# Altium schematic sheet Invertor.SchDoc (part 1 of 2)
size A0; SheetNumber: 1; SheetTotal: 1
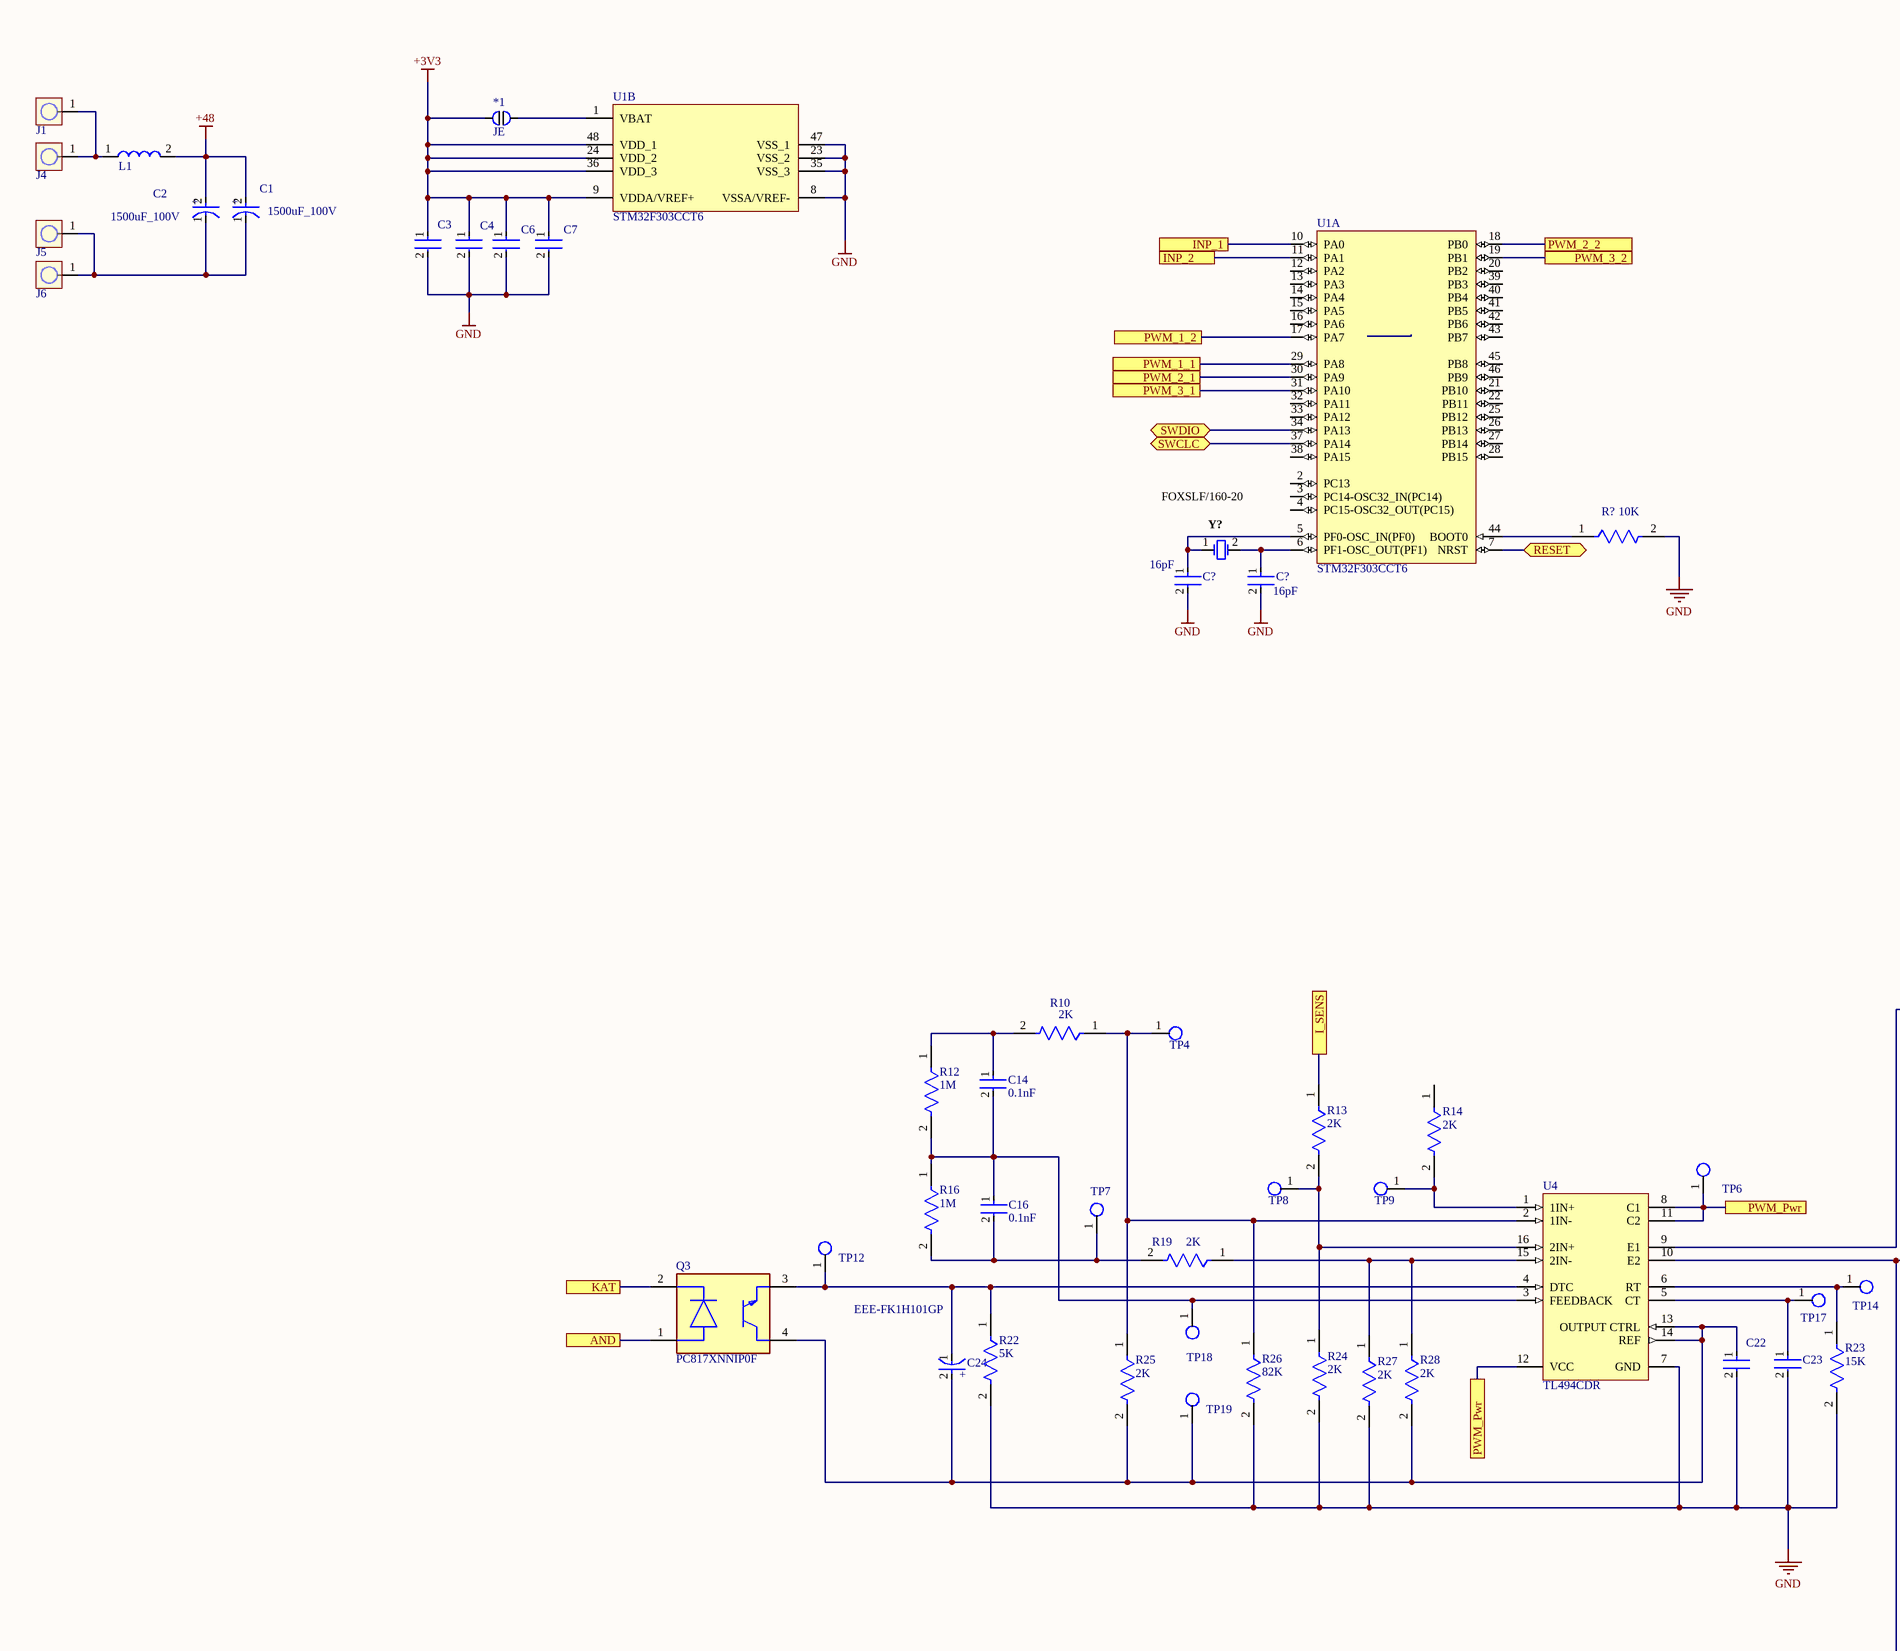
[diagram p0: Invertor.SchDoc, top left]
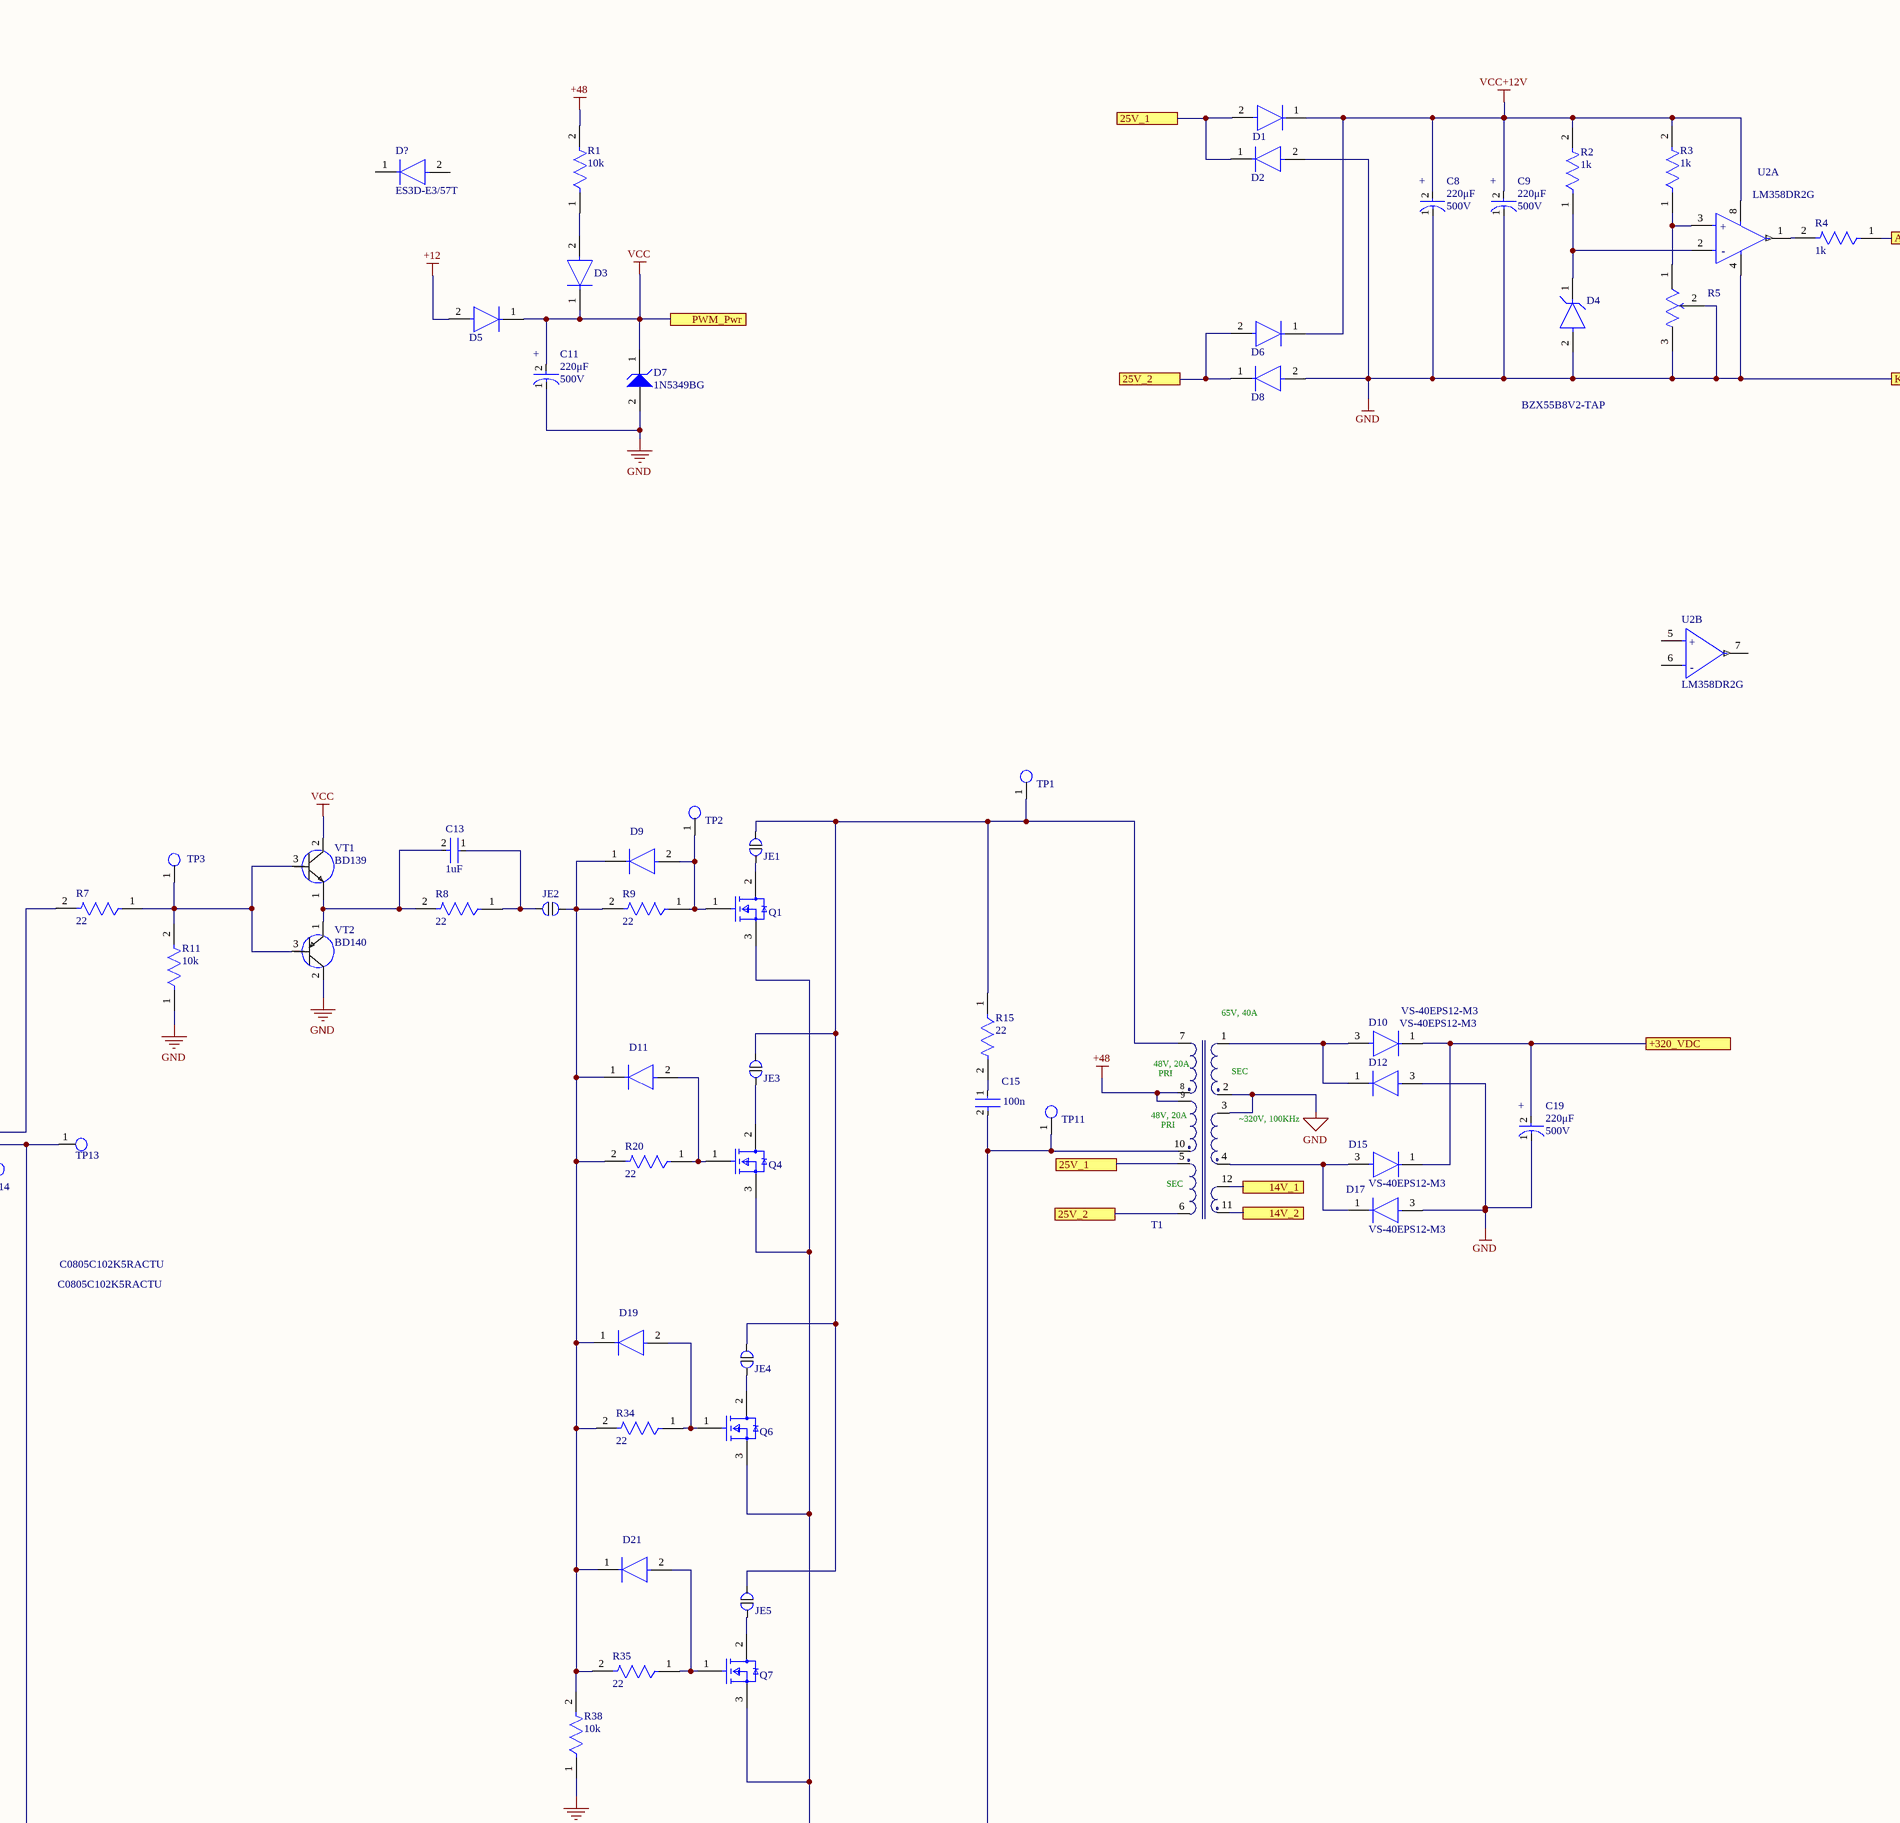
[diagram p1: Invertor.SchDoc, top middle]
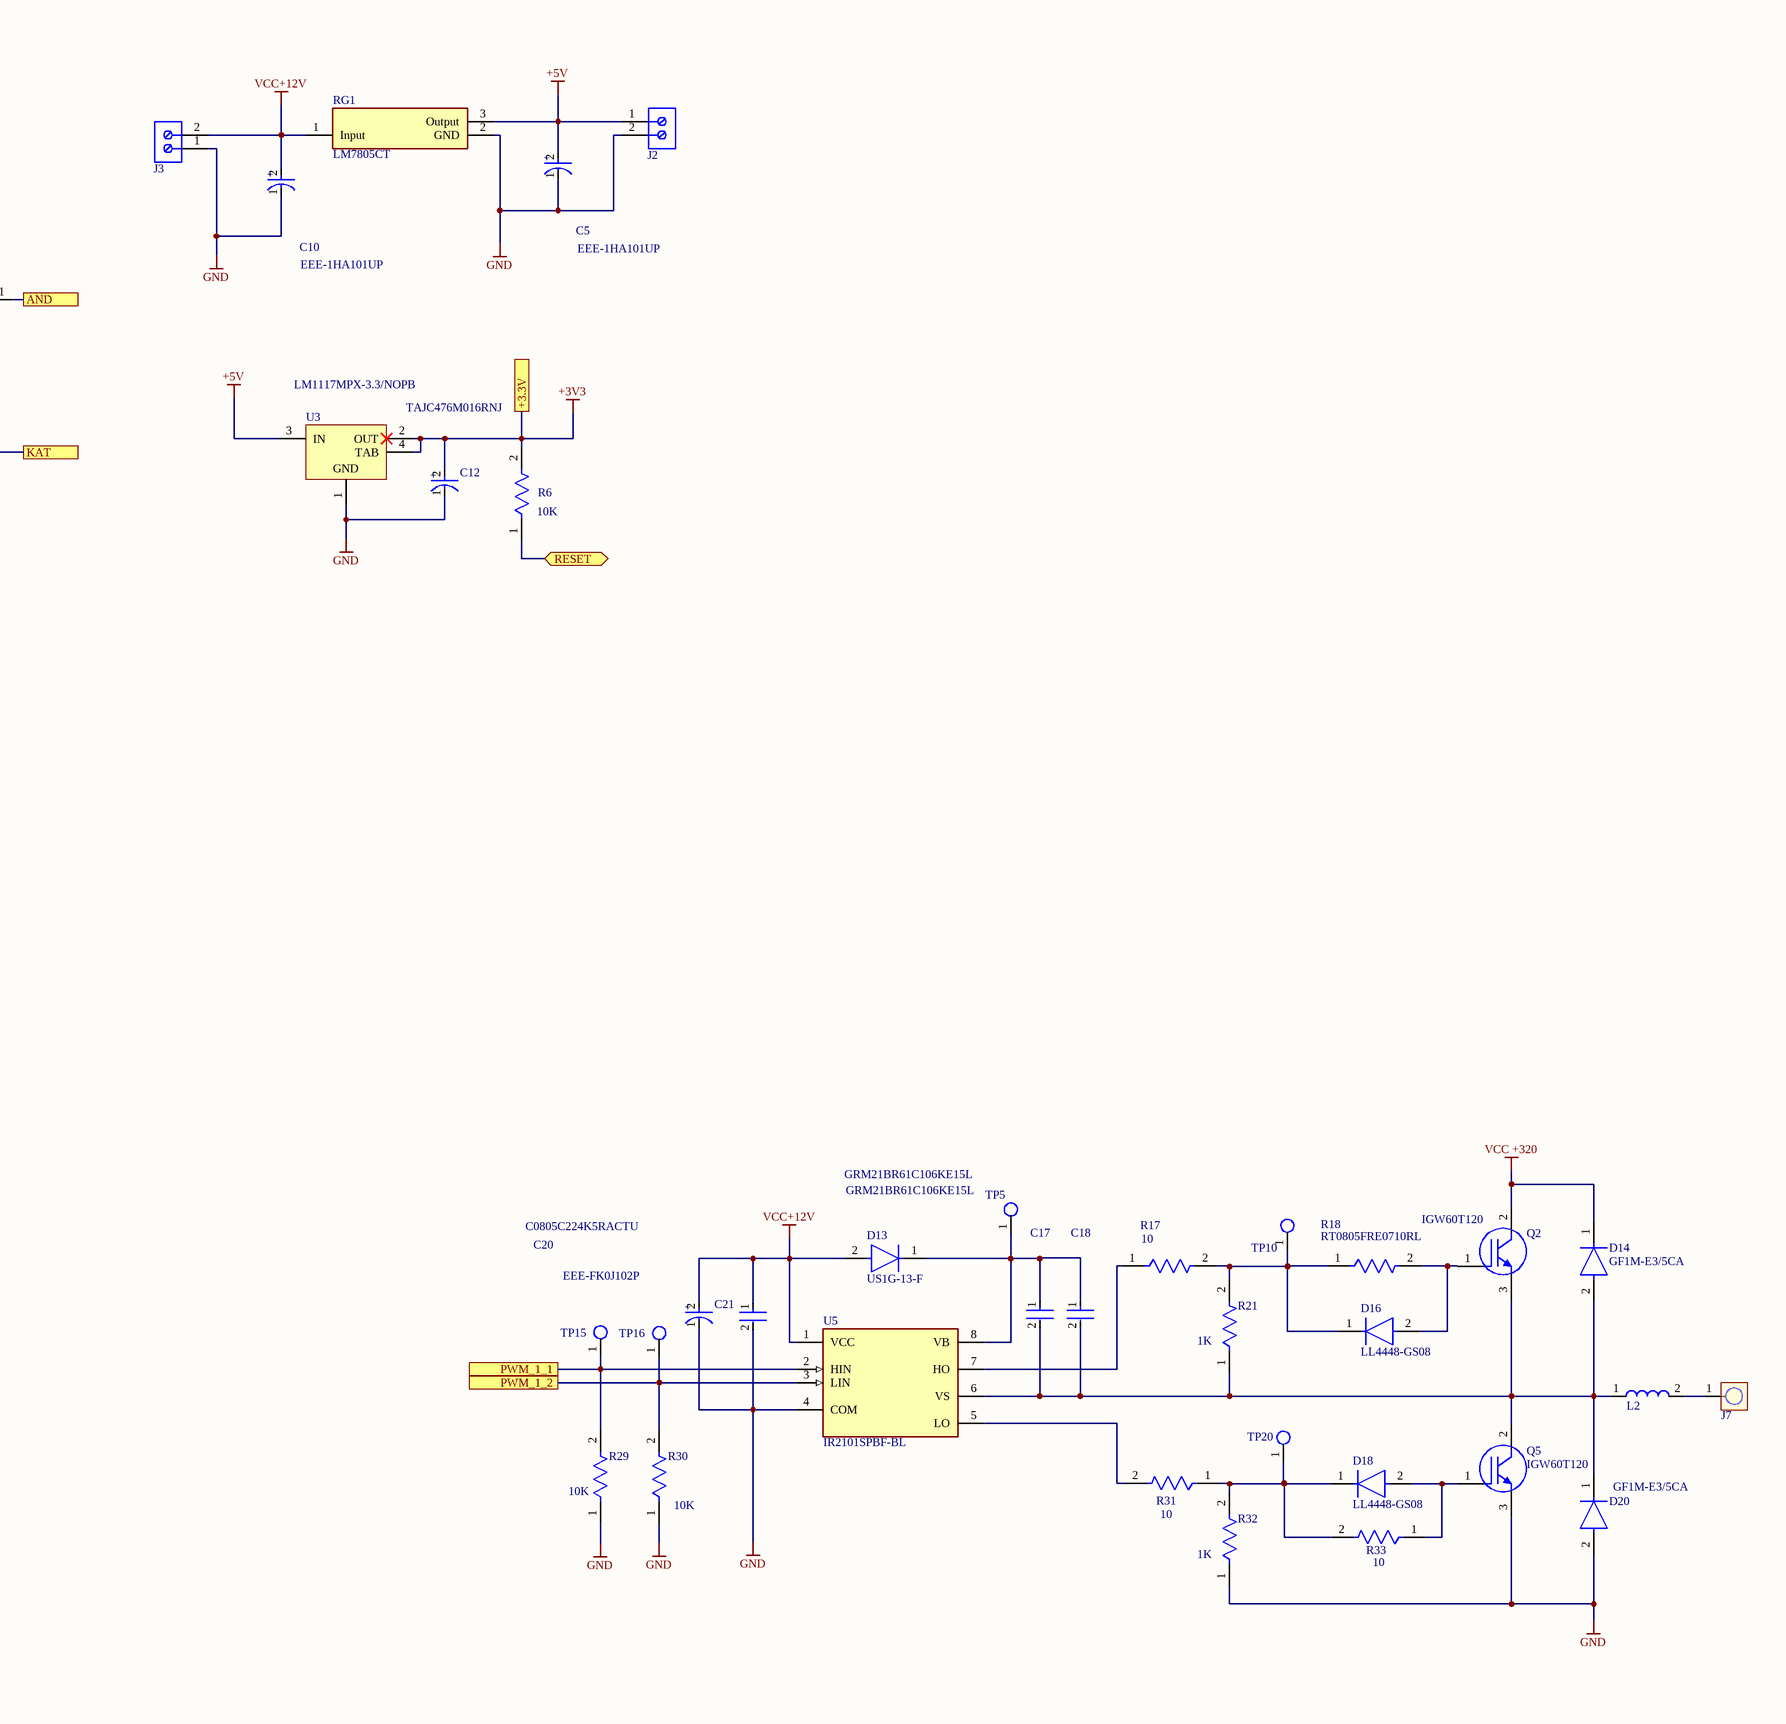
[diagram p2: Invertor.SchDoc, top right]
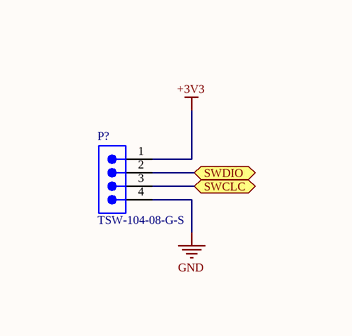
[diagram p3: Invertor.SchDoc, bottom left]
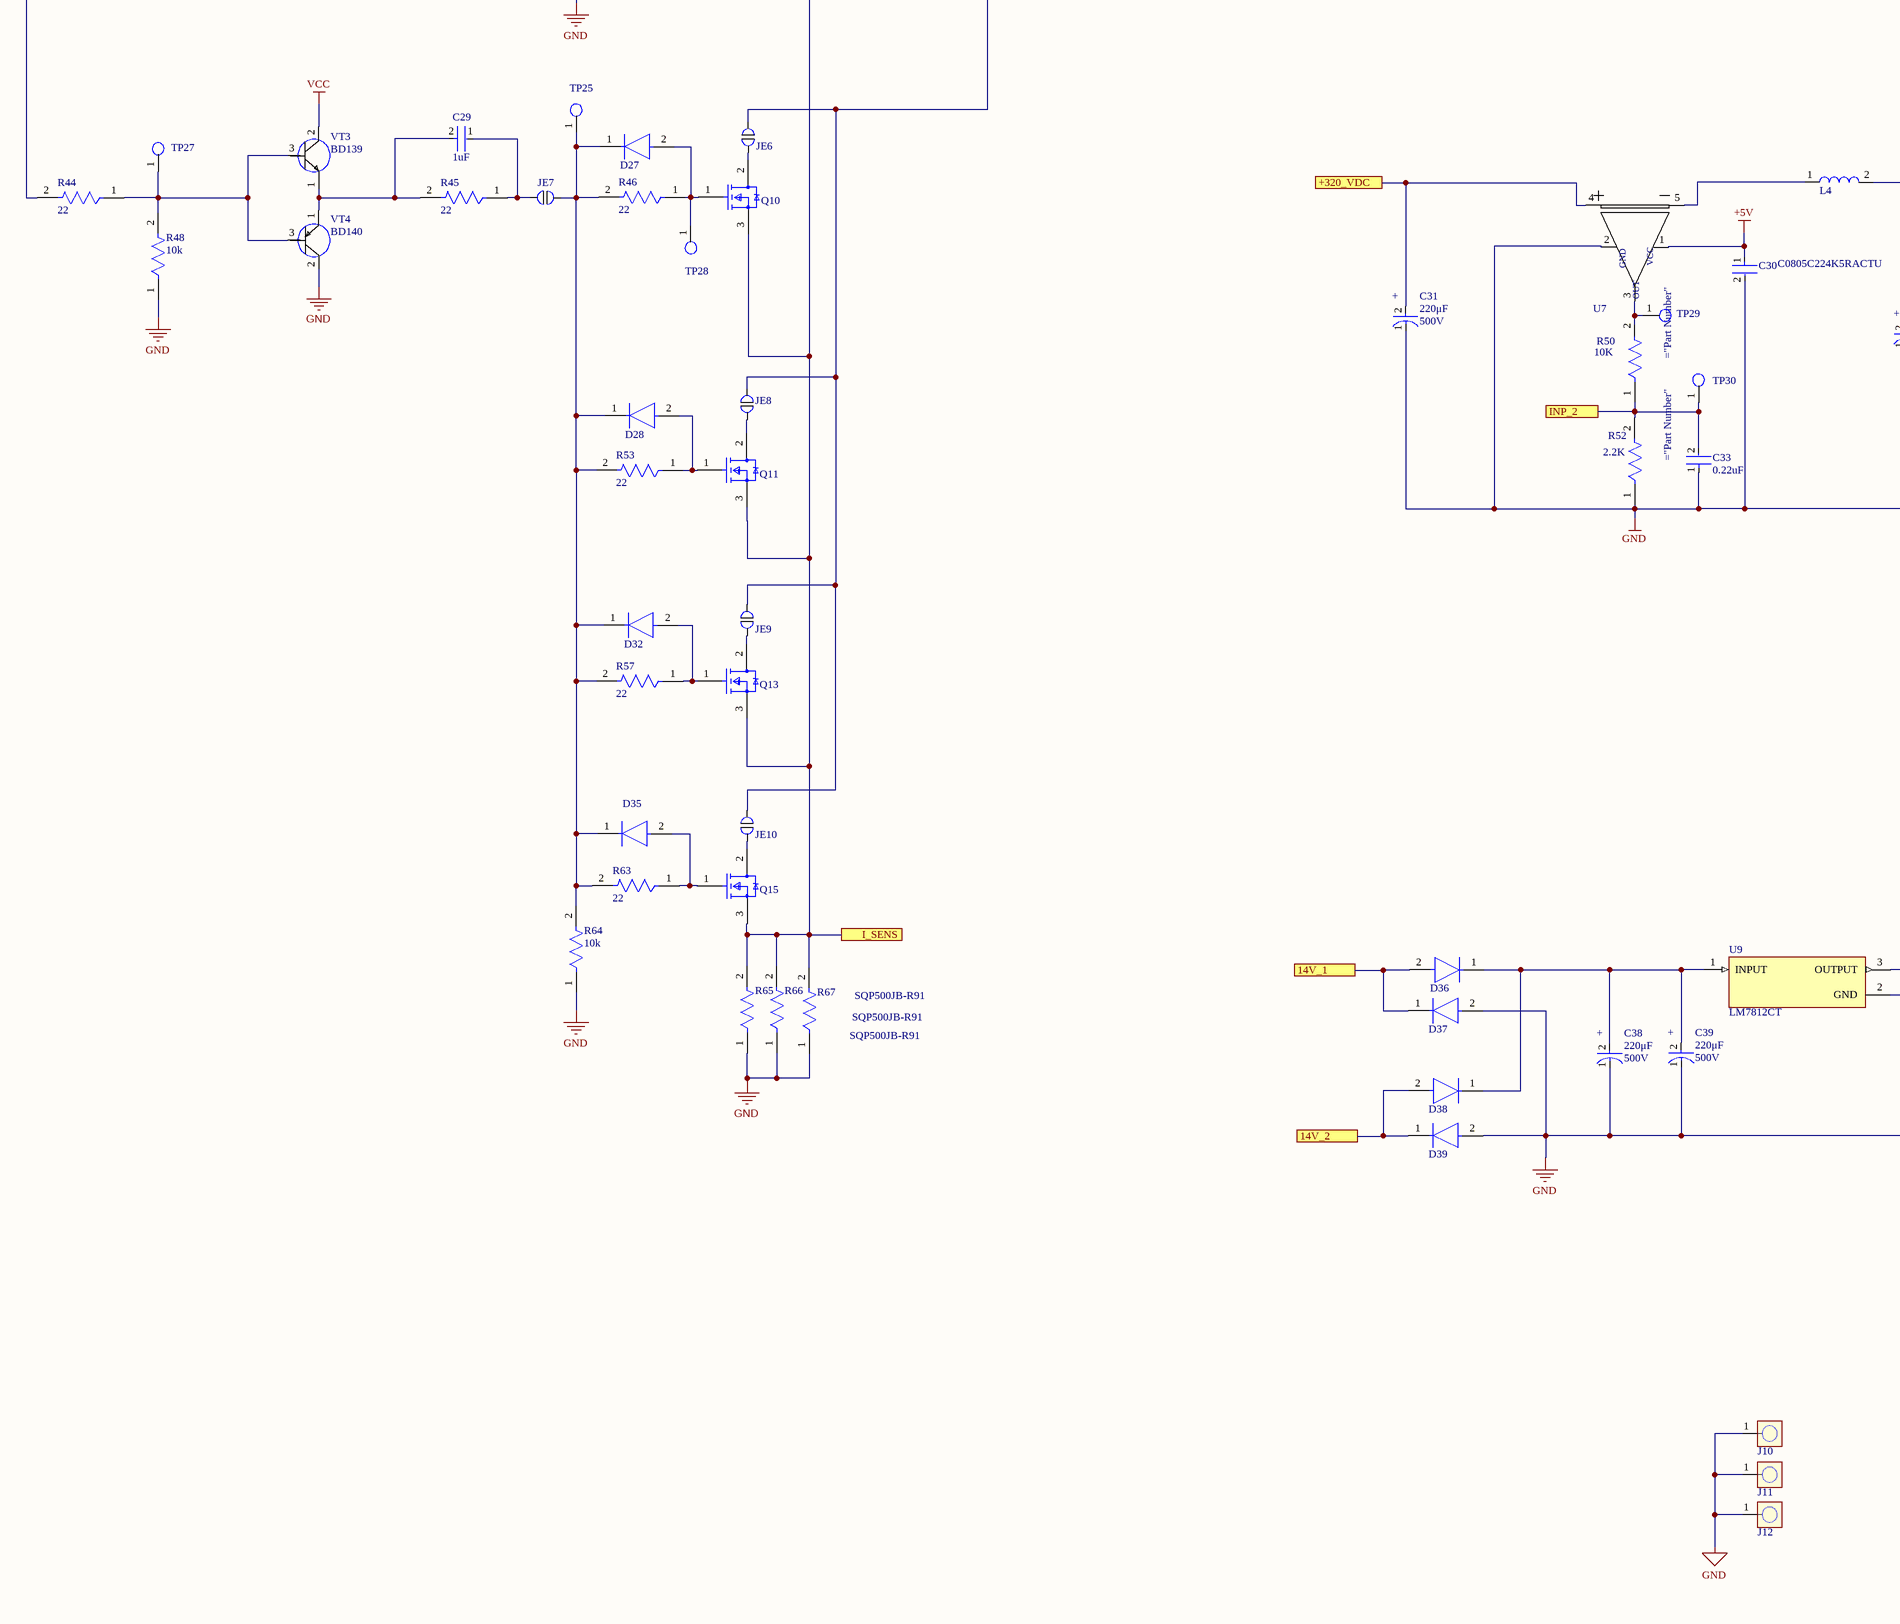
[diagram p4: Invertor.SchDoc, bottom middle]
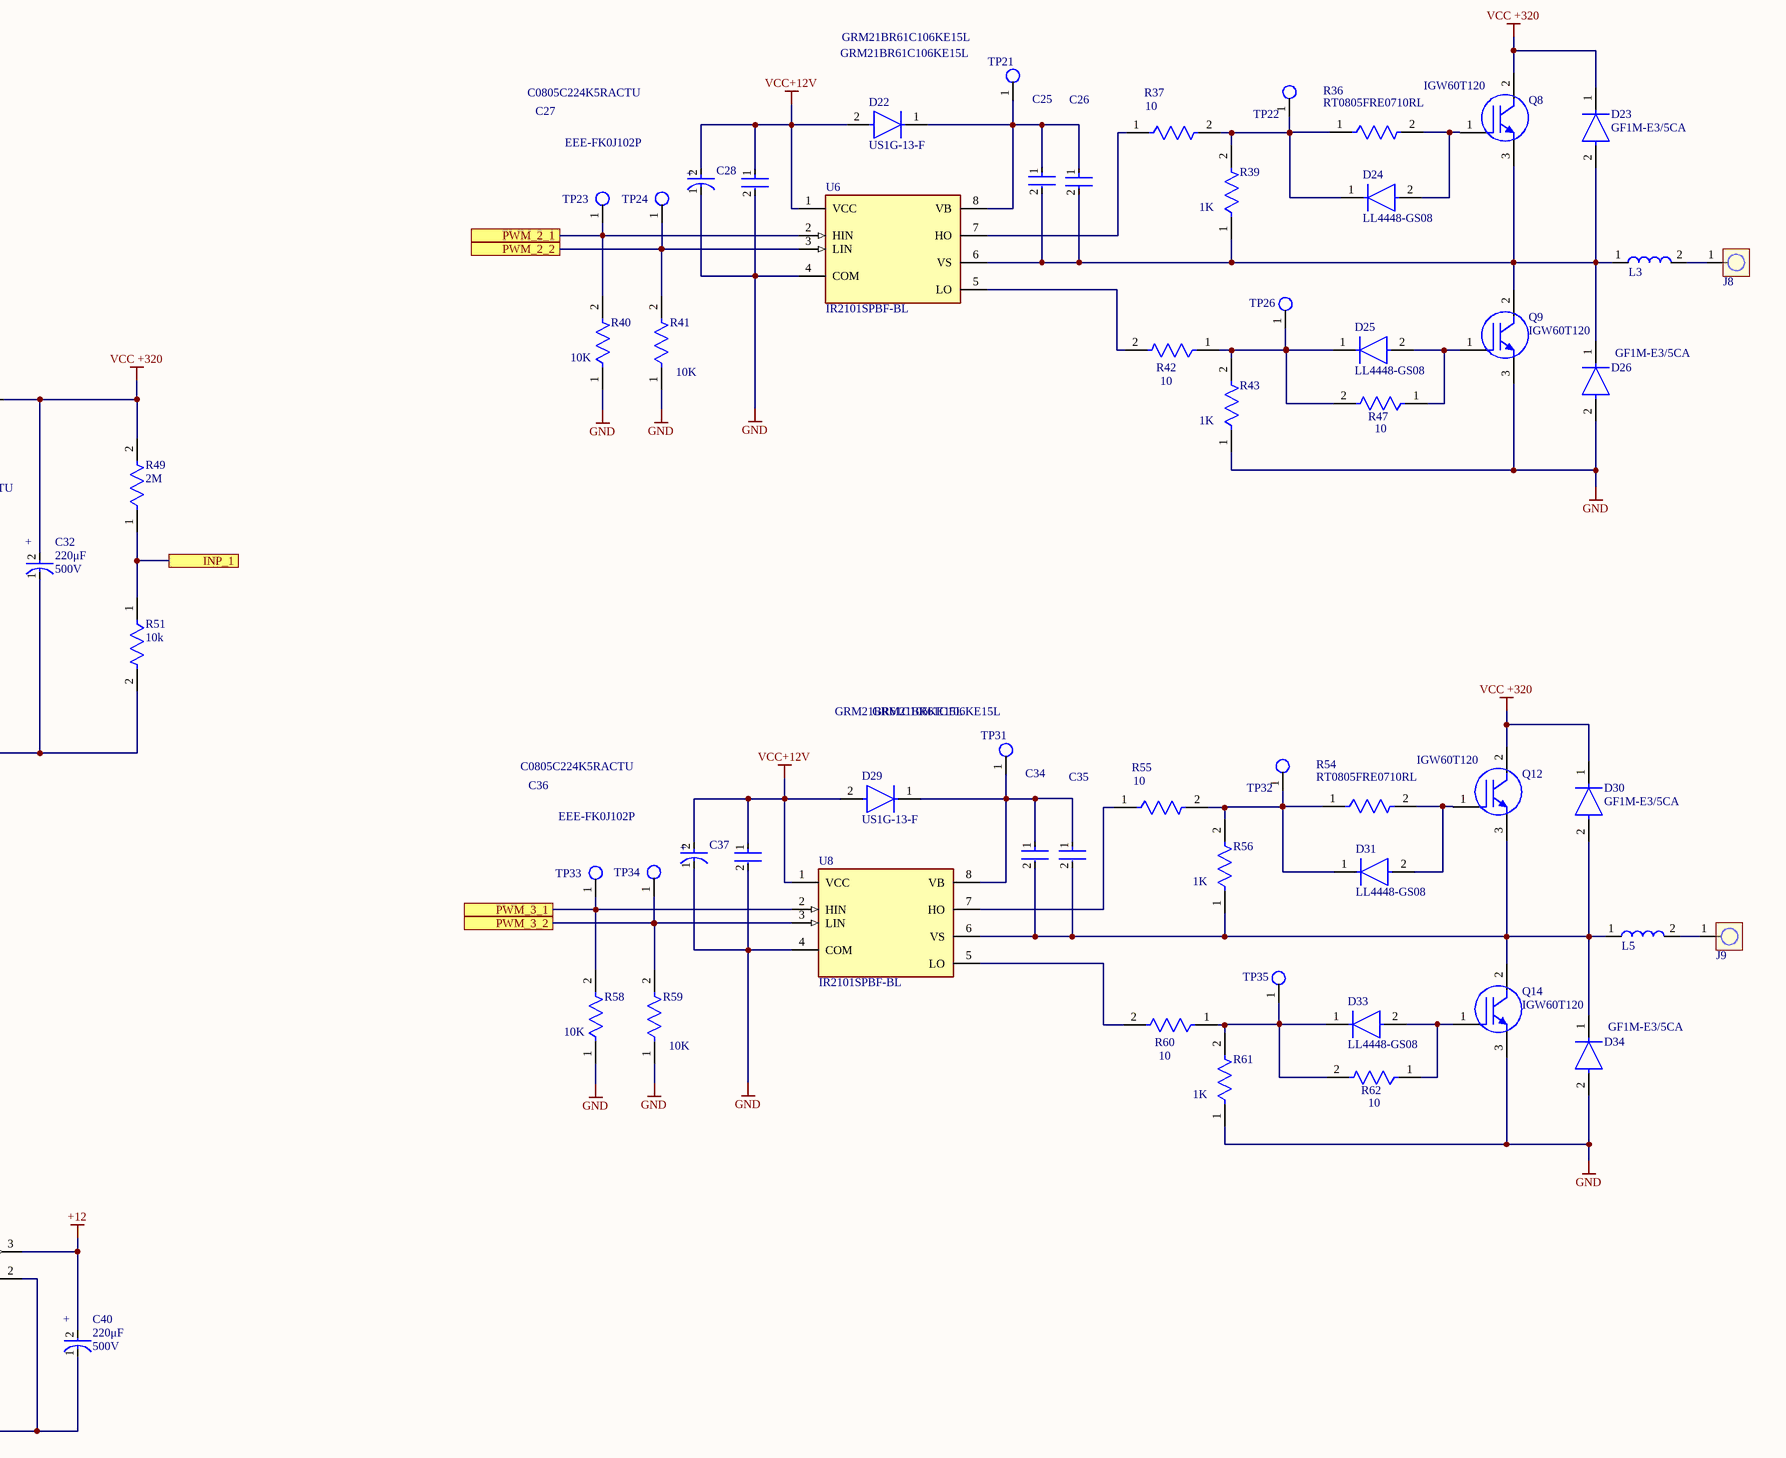
[diagram p5: Invertor.SchDoc, bottom right]

## Parts
(Parts that share a designator on the sheet are numbered #1, #2 ... from top to bottom, then left to right.)
*1  JE  [JE]
C1  1500uF_100V  [1500uF_100V]
C2  1500uF_100V  [1500uF_100V]
C3  (no value)  [FP-C0805C-DN-IPC_A]
C4  (no value)  [FP-C0805C-DN-IPC_A]
C5  EEE-1HA101UP  [FP-SF-MFG]
C6  (no value)  [FP-C0805C-DN-IPC_A]
C7  (no value)  [FP-C0805C-DN-IPC_A]
C8  Capacitance: 220μF  Voltage: 500V  [CAP 330uF 450V]  (hidden comment: Cap_Vishay_MAL219390101E3_eec)
C9  Capacitance: 220μF  Voltage: 500V  [CAP 330uF 450V]  (hidden comment: Cap_Vishay_MAL219390101E3_eec)
C10  EEE-1HA101UP  [FP-SF-MFG]
C11  Capacitance: 220μF  Voltage: 500V  [CAP 330uF 450V]  (hidden comment: Cap_Vishay_MAL219390101E3_eec)
C12  TAJC476M016RNJ  [FP-TAJC-MFG]
C13  1uF  [KEMET_C0805C-DN_IPC_C]
C14  0.1nF  [FP-C0805C-DN-MFG]
C15  100n  [KEMET_C0805C-DN_IPC_C]
C16  0.1nF  [FP-C0805C-DN-MFG]
C17  GRM21BR61C106KE15L  [FP-GRM21B-0_1-IPC_C]
C18  GRM21BR61C106KE15L  [FP-GRM21B-0_1-IPC_C]
C19  Capacitance: 220μF  Voltage: 500V  [CAP 330uF 450V]  (hidden comment: Cap_Vishay_MAL219390101E3_eec)
C20  C0805C224K5RACTU  [FP-C0805C-DN-MFG]
C21  EEE-FK0J102P  [FP-FKF-MFG]
C22  C0805C102K5RACTU  [FP-C0805C-DN-MFG]
C23  C0805C102K5RACTU  [FP-C0805C-DN-MFG]
C24  EEE-FK1H101GP  [FP-FKF-MFG]
C25  GRM21BR61C106KE15L  [FP-GRM21B-0_1-IPC_C]
C26  GRM21BR61C106KE15L  [FP-GRM21B-0_1-IPC_C]
C27  C0805C224K5RACTU  [FP-C0805C-DN-MFG]
C28  EEE-FK0J102P  [FP-FKF-MFG]
C29  1uF  [KEMET_C0805C-DN_IPC_C]
C30  C0805C224K5RACTU  [FP-C0805C-DN-MFG]
C31  Capacitance: 220μF  Voltage: 500V  [CAP 330uF 450V]  (hidden comment: Cap_Vishay_MAL219390101E3_eec)
C32  Capacitance: 220μF  Voltage: 500V  [CAP 330uF 450V]  (hidden comment: Cap_Vishay_MAL219390101E3_eec)
C33  0.22uF  [FP-C0805C-DN-MFG]
C34  GRM21BR61C106KE15L  [FP-GRM21B-0_1-IPC_C]
C35  GRM21BR61C106KE15L  [FP-GRM21B-0_1-IPC_C]
C36  C0805C224K5RACTU  [FP-C0805C-DN-MFG]
C37  EEE-FK0J102P  [FP-FKF-MFG]
C38  Capacitance: 220μF  Voltage: 500V  [CAP 330uF 450V]  (hidden comment: Cap_Vishay_MAL219390101E3_eec)
C39  Capacitance: 220μF  Voltage: 500V  [CAP 330uF 450V]  (hidden comment: Cap_Vishay_MAL219390101E3_eec)
C40  Capacitance: 220μF  Voltage: 500V  [CAP 330uF 450V]  (hidden comment: Cap_Vishay_MAL219390101E3_eec)
C?#1  16pF  [FP-C0805C-DN-IPC_A]
C?#2  16pF  [FP-C0805C-DN-IPC_A]
D1  Diode_Fairchild-ON_Semiconductor_LL4148_eec  [TO-247-2]  (value not drawn)
D2  Diode_Fairchild-ON_Semiconductor_LL4148_eec  [TO-247-2]  (value not drawn)
D3  Diode_Fairchild-ON_Semiconductor_LL4148_eec  [Fairchild-ON_Semiconductor_LL4148_0]  (value not drawn)
D4  BZX55B8V2-TAP  [FP-SB-V-3906_04-031_4-MFG]
D5  Diode_Fairchild-ON_Semiconductor_LL4148_eec  [Fairchild-ON_Semiconductor_LL4148_0]  (value not drawn)
D6  Diode_Fairchild-ON_Semiconductor_LL4148_eec  [TO-247-2]  (value not drawn)
D7  1N5349BG  [ONSC-SURMETIC40-2-017AA-01]
D8  Diode_Fairchild-ON_Semiconductor_LL4148_eec  [TO-247-2]  (value not drawn)
D9  Diode_Fairchild-ON_Semiconductor_LL4148_eec  [Fairchild-ON_Semiconductor_LL4148_0]  (value not drawn)
D10  VS-40EPS12-M3  [FP-96144-MFG]
D11  Diode_Fairchild-ON_Semiconductor_LL4148_eec  [Fairchild-ON_Semiconductor_LL4148_0]  (value not drawn)
D12  VS-40EPS12-M3  [FP-96144-MFG]
D13  US1G-13-F  [FP-SMA-MFG]
D14  GF1M-E3/5CA  [FP-GF1M-E3-5CA-MFG]
D15  VS-40EPS12-M3  [FP-96144-MFG]
D16  LL4448-GS08  [FP-6_560-5005_01-4-MFG]
D17  VS-40EPS12-M3  [FP-96144-MFG]
D18  LL4448-GS08  [FP-6_560-5005_01-4-MFG]
D19  Diode_Fairchild-ON_Semiconductor_LL4148_eec  [Fairchild-ON_Semiconductor_LL4148_0]  (value not drawn)
D20  GF1M-E3/5CA  [FP-GF1M-E3-5CA-MFG]
D21  Diode_Fairchild-ON_Semiconductor_LL4148_eec  [Fairchild-ON_Semiconductor_LL4148_0]  (value not drawn)
D22  US1G-13-F  [FP-SMA-MFG]
D23  GF1M-E3/5CA  [FP-GF1M-E3-5CA-MFG]
D24  LL4448-GS08  [FP-6_560-5005_01-4-MFG]
D25  LL4448-GS08  [FP-6_560-5005_01-4-MFG]
D26  GF1M-E3/5CA  [FP-GF1M-E3-5CA-MFG]
D27  Diode_Fairchild-ON_Semiconductor_LL4148_eec  [Fairchild-ON_Semiconductor_LL4148_0]  (value not drawn)
D28  Diode_Fairchild-ON_Semiconductor_LL4148_eec  [Fairchild-ON_Semiconductor_LL4148_0]  (value not drawn)
D29  US1G-13-F  [FP-SMA-MFG]
D30  GF1M-E3/5CA  [FP-GF1M-E3-5CA-MFG]
D31  LL4448-GS08  [FP-6_560-5005_01-4-MFG]
D32  Diode_Fairchild-ON_Semiconductor_LL4148_eec  [Fairchild-ON_Semiconductor_LL4148_0]  (value not drawn)
D33  LL4448-GS08  [FP-6_560-5005_01-4-MFG]
D34  GF1M-E3/5CA  [FP-GF1M-E3-5CA-MFG]
D35  Diode_Fairchild-ON_Semiconductor_LL4148_eec  [Fairchild-ON_Semiconductor_LL4148_0]  (value not drawn)
D36  Diode_Fairchild-ON_Semiconductor_LL4148_eec  [TO-247-2]  (value not drawn)
D37  Diode_Fairchild-ON_Semiconductor_LL4148_eec  [TO-247-2]  (value not drawn)
D38  Diode_Fairchild-ON_Semiconductor_LL4148_eec  [TO-247-2]  (value not drawn)
D39  Diode_Fairchild-ON_Semiconductor_LL4148_eec  [TO-247-2]  (value not drawn)
D?  ES3D-E3/57T  [FP-95402-MFG]
J1  (no value)  [KLS8-M3]
J2  691101710002  [691101710002]  (value not drawn)
J3  691101710002  [691101710002]  (value not drawn)
J4  (no value)  [KLS8-M3]
J5  KLS8-M3  [KLS8-M3]  (value not drawn)
J6  KLS8-M3  [KLS8-M3]  (value not drawn)
J7  KLS8-M3  [KLS8-M3]  (value not drawn)
J8  KLS8-M3  [KLS8-M3]  (value not drawn)
J9  KLS8-M3  [KLS8-M3]  (value not drawn)
J10  KLS8-M3  [KLS8-M3]  (value not drawn)
J11  KLS8-M3  [KLS8-M3]  (value not drawn)
J12  KLS8-M3  [KLS8-M3]  (value not drawn)
JE1  Jumper  [JE]  (value not drawn)
JE2  Jumper  [JE]  (value not drawn)
JE3  Jumper  [JE]  (value not drawn)
JE4  Jumper  [JE]  (value not drawn)
JE5  Jumper  [JE]  (value not drawn)
JE6  Jumper  [JE]  (value not drawn)
JE7  Jumper  [JE]  (value not drawn)
JE8  Jumper  [JE]  (value not drawn)
JE9  Jumper  [JE]  (value not drawn)
JE10  Jumper  [JE]  (value not drawn)
L1  Coil  [Coil_drosel]  (value not drawn)
L2  Coil  [Coil_drosel]  (value not drawn)
L3  Coil  [Coil_drosel]  (value not drawn)
L4  Coil  [Coil_drosel]  (value not drawn)
L5  Coil  [Coil_drosel]  (value not drawn)
P?  TSW-104-08-G-S  [SMTC-TSW-104-08-X-S]
Q1  IRF740PBF  [Vishay_X15-0364_MFG]  (value not drawn)
Q2  IGW60T120  [TO-264-3]
Q3  PC817XNNIP0F  [FP-PC817XNNIP0F-MFG]
Q4  IRF740PBF  [Vishay_X15-0364_MFG]  (value not drawn)
Q5  IGW60T120  [TO-264-3]
Q6  IRF740PBF  [Vishay_X15-0364_MFG]  (value not drawn)
Q7  IRF740PBF  [Vishay_X15-0364_MFG]  (value not drawn)
Q8  IGW60T120  [TO-264-3]
Q9  IGW60T120  [TO-264-3]
Q10  IRF740PBF  [MOSFET_BEND_rad]  (value not drawn)
Q11  IRF740PBF  [MOSFET_BEND_rad]  (value not drawn)
Q12  IGW60T120  [TO-264-3]
Q13  IRF740PBF  [MOSFET_BEND_rad]  (value not drawn)
Q14  IGW60T120  [TO-264-3]
Q15  IRF740PBF  [MOSFET_BEND_rad]  (value not drawn)
R1  10k  [Vishay_CRCW0805-e3_IPC_A]
R2  1k  [Vishay_CRCW0805-e3_IPC_A]
R3  1k  [Vishay_CRCW0805-e3_IPC_A]
R4  1k  [Vishay_CRCW0805-e3_IPC_A]
R5  3296W-1-202LF  [Bourns_3296W_MFG]  (value not drawn)
R6  10K  [Vishay_CRCW0805-e3_IPC_A]
R7  22  [Vishay_CRCW0805-e3_IPC_A]
R8  22  [Vishay_CRCW0805-e3_IPC_A]
R9  22  [Vishay_CRCW0805-e3_IPC_A]
R10  2K  [FP-CRCW0805-e3-MFG]
R11  10k  [Vishay_CRCW0805-e3_IPC_A]
R12  1M  [FP-CRCW0805-e3-MFG]
R13  2K  [FP-CRCW0805-e3-MFG]
R14  2K  [FP-CRCW0805-e3-MFG]
R15  22  [Vishay_CRCW0805-e3_IPC_A]
R16  1M  [FP-CRCW0805-e3-MFG]
R17  10  [FP-RT0805-MFG]
R18  RT0805FRE0710RL  [FP-RT0805-IPC_C]
R19  2K  [FP-CRCW0805-e3-MFG]
R20  22  [Vishay_CRCW0805-e3_IPC_A]
R21  1K  [FP-CRCW0805-e3-IPC_A]
R22  5K  [FP-CRCW0805-e3-MFG]
R23  15K  [FP-CRCW0805-e3-MFG]
R24  2K  [FP-CRCW0805-e3-MFG]
R25  2K  [FP-CRCW0805-e3-MFG]
R26  82K  [FP-CRCW0805-e3-MFG]
R27  2K  [FP-CRCW0805-e3-MFG]
R28  2K  [FP-CRCW0805-e3-MFG]
R29  10K  [FP-CRCW0805-e3-IPC_A]
R30  10K  [FP-CRCW0805-e3-IPC_A]
R31  10  [Vishay_CRCW0805-e3_IPC_A]
R32  1K  [FP-CRCW0805-e3-IPC_A]
R33  10  [FP-CRCW0805-e3-IPC_B]
R34  22  [Vishay_CRCW0805-e3_IPC_A]
R35  22  [Vishay_CRCW0805-e3_IPC_A]
R36  RT0805FRE0710RL  [FP-RT0805-IPC_C]
R37  10  [FP-RT0805-MFG]
R38  10k  [Vishay_CRCW0805-e3_IPC_A]
R39  1K  [FP-CRCW0805-e3-IPC_A]
R40  10K  [FP-CRCW0805-e3-IPC_A]
R41  10K  [FP-CRCW0805-e3-IPC_A]
R42  10  [Vishay_CRCW0805-e3_IPC_A]
R43  1K  [FP-CRCW0805-e3-IPC_A]
R44  22  [Vishay_CRCW0805-e3_IPC_A]
R45  22  [Vishay_CRCW0805-e3_IPC_A]
R46  22  [Vishay_CRCW0805-e3_IPC_A]
R47  10  [FP-CRCW0805-e3-IPC_B]
R48  10k  [Vishay_CRCW0805-e3_IPC_A]
R49  2M  [Vishay_CRCW0805-e3_IPC_A]
R50  10K  [Vishay_CRCW0805-e3_IPC_A]
R51  10k  [Vishay_CRCW0805-e3_IPC_A]
R52  2.2K  [Vishay_CRCW0805-e3_IPC_A]
R53  22  [Vishay_CRCW0805-e3_IPC_A]
R54  RT0805FRE0710RL  [FP-RT0805-IPC_C]
R55  10  [FP-RT0805-MFG]
R56  1K  [FP-CRCW0805-e3-IPC_A]
R57  22  [Vishay_CRCW0805-e3_IPC_A]
R58  10K  [FP-CRCW0805-e3-IPC_A]
R59  10K  [FP-CRCW0805-e3-IPC_A]
R60  10  [Vishay_CRCW0805-e3_IPC_A]
R61  1K  [FP-CRCW0805-e3-IPC_A]
R62  10  [FP-CRCW0805-e3-IPC_B]
R63  22  [Vishay_CRCW0805-e3_IPC_A]
R64  10k  [Vishay_CRCW0805-e3_IPC_A]
R65  SQP500JB-R91  [FP-SQP500-MFG]
R66  SQP500JB-R91  [FP-SQP500-MFG]
R67  SQP500JB-R91  [FP-SQP500-MFG]
R?  10K  [Vishay_CRCW0805-e3_IPC_A]
RG1  Part Number: LM7805CT  [TO-220(bend_rad)]  (hidden comment: Reg_Fairchild_LM7805CT_eec)
T1  ETD59  [ETD-59_3F]  (value not drawn)
TP1  Test_Point_PCB  [Test_Point]  (value not drawn)
TP2  Test_Point_PCB  [Test_Point]  (value not drawn)
TP3  Test_Point_PCB  [Test_Point]  (value not drawn)
TP4  Test_Point_PCB  [Test_Point]  (value not drawn)
TP5  Test_Point_PCB  [Test_Point]  (value not drawn)
TP6  Test_Point_PCB  [Test_Point]  (value not drawn)
TP7  Test_Point_PCB  [Test_Point]  (value not drawn)
TP8  Test_Point_PCB  [Test_Point]  (value not drawn)
TP9  Test_Point_PCB  [Test_Point]  (value not drawn)
TP10  Test_Point_PCB  [Test_Point]  (value not drawn)
TP11  Test_Point_PCB  [Test_Point]  (value not drawn)
TP12  Test_Point_PCB  [Test_Point]  (value not drawn)
TP13  Test_Point_PCB  [Test_Point]  (value not drawn)
TP14  Test_Point_PCB  [Test_Point]  (value not drawn)
TP15  Test_Point_PCB  [Test_Point]  (value not drawn)
TP16  Test_Point_PCB  [Test_Point]  (value not drawn)
TP17  Test_Point_PCB  [Test_Point]  (value not drawn)
TP18  Test_Point_PCB  [Test_Point]  (value not drawn)
TP19  Test_Point_PCB  [Test_Point]  (value not drawn)
TP20  Test_Point_PCB  [Test_Point]  (value not drawn)
TP21  Test_Point_PCB  [Test_Point]  (value not drawn)
TP22  Test_Point_PCB  [Test_Point]  (value not drawn)
TP23  Test_Point_PCB  [Test_Point]  (value not drawn)
TP24  Test_Point_PCB  [Test_Point]  (value not drawn)
TP25  Test_Point_PCB  [Test_Point]  (value not drawn)
TP26  Test_Point_PCB  [Test_Point]  (value not drawn)
TP27  Test_Point_PCB  [Test_Point]  (value not drawn)
TP28  Test_Point_PCB  [Test_Point]  (value not drawn)
TP29  Test_Point_PCB  [Test_Point]  (value not drawn)
TP30  Test_Point_PCB  [Test_Point]  (value not drawn)
TP31  Test_Point_PCB  [Test_Point]  (value not drawn)
TP32  Test_Point_PCB  [Test_Point]  (value not drawn)
TP33  Test_Point_PCB  [Test_Point]  (value not drawn)
TP34  Test_Point_PCB  [Test_Point]  (value not drawn)
TP35  Test_Point_PCB  [Test_Point]  (value not drawn)
U1  STM32F303CCT6  [STM-LQFP48_M]  (parts A,B of 2)
U2  LM358DR2G  [FP-751-07-IPC_C]  (parts A,B of 2)
U3  LM1117MPX-3.3/NOPB  [DCY0004A_L]
U4  TL494CDR  [D0016A_N]
U5  IR2101SPBF-BL  [FP-PG-DSO-8-IPC_B]
U6  IR2101SPBF-BL  [FP-PG-DSO-8-IPC_B]
U7  ACS758  [ACS758-100]  (value not drawn)
U8  IR2101SPBF-BL  [FP-PG-DSO-8-IPC_B]
U9  LM7812CT  [FP-TO220B03-MFG]
VT1  BD139  [TO-126(bend2)]
VT2  BD140  [TO-126(bend2)]
VT3  BD139  [TO-126(bend2)]
VT4  BD140  [TO-126(bend2)]
Y?  FOXSLF/160-20  [FOX-FOXSLF160-20]

## Ports
14V_1, 14V_2, 25V_1, 25V_2, +3.3V, +320_VDC, AND, I_SENS, INP_1, INP_2, KAT, PWM_1_1, PWM_1_2, PWM_2_1, PWM_2_2, PWM_3_1, PWM_3_2, PWM_Pwr, RESET (bidir), SWCLC (bidir), SWDIO (bidir)

## Nets
+3V3: *1.1 C3.1 C4.1 C6.1 C7.1 C12.2(A) P?.1 R6.2 U1.9(VDDA/VREF+) U1.24(VDD_2) U1.36(VDD_3) U1.48(VDD_1) U3.2(OUT) U3.4(TAB) ; port +3.3V
+5V: C5.2(A) C30.1 J2.1 RG1.3(Output) U3.3(IN) U7.1(+VCC)
+12: C40.2(A) D5.2(A) U9.3(OUTPUT)
+48: C1.2(A) C2.2(A) L1.2 R1.2 T1.8 T1.9
GND: C3.2 C4.2 C5.1(C) C6.2 C7.2 C8.1(C) C9.1(C) C10.1(C) C11.1(C) C12.1(C) C19.1(C) C20.2 C21.1(C) C22.2 C23.2 C27.2 C28.1(C) C30.2 C31.1(C) C32.1(C) C33.1 C36.2 C37.1(C) C38.1(C) C39.1(C) C40.1(C) C?#1.2 C?#2.2 D2.2(A) D4.2(A) D7.2(A) D8.2(A) D12.3(A) D17.3(A) D20.2(A) D26.2(A) D34.2(A) D37.2(A) D39.2(A) J2.2 J3.1 J10.1 J11.1 J12.1 P?.4 Q3.2(C) Q5.3(E) Q9.3(E) Q14.3(E) R5.2(WIPER) R5.3(CW) R11.1 R22.2 R23.2 R24.2 R26.2 R27.2 R29.1 R30.1 R32.1 R38.1 R40.1 R41.1 R43.1 R48.1 R51.2 R52.1 R58.1 R59.1 R61.1 R64.1 R65.1 R66.1 R67.1 R?.2 RG1.2(GND) T1.2 T1.3 U1.8(VSSA/VREF-) U1.23(VSS_2) U1.35(VSS_3) U1.47(VSS_1) U2.4(VEE/GND) U3.1(GND) U4.7(GND) U5.4(COM) U6.4(COM) U7.2(GND) U8.4(COM) U9.2(GND) VT2.2(C) VT4.2(C) ; port KAT
VCC: C11.2(A) D3.1(C) D5.1(C) D7.1(K) TP6.1(G9) U4.8(C1) U4.11(C2) U4.12(VCC) VT1.2(C) VT3.2(C) ; port PWM_Pwr
VCC +320: C32.2(A) D14.1(C) D23.1(C) D30.1(C) L4.2 Q2.2(C) Q8.2(C) Q12.2(C) R49.2
VCC+12V: C8.2(A) C9.2(A) C10.2(A) C20.1 C21.2(A) C27.1 C28.2(A) C36.1 C37.2(A) D1.1(C) D6.1(C) D13.2(A) D22.2(A) D29.2(A) J3.2 R2.2 R3.2 RG1.1(Input) U2.8(VCC) U5.1(VCC) U6.1(VCC) U8.1(VCC)
14V_1: D36.2(A) D37.1(C) T1.12 ; port 14V_1
14V_2: D38.2(A) D39.1(C) T1.11 ; port 14V_2
25V_1: D1.2(A) D2.1(C) T1.5 ; port 25V_1
25V_2: D6.2(A) D8.1(C) T1.6 ; port 25V_2
+320_VDC: C19.2(A) C31.2(A) D10.1(C) D15.1(C) U7.4(+IP) ; port +320_VDC
AND: Q3.1(A) R4.1 ; port AND
I_SENS: Q1.3(S) Q4.3(S) Q6.3(S) Q7.3(S) Q10.3(S) Q11.3(S) Q13.3(S) Q15.3(S) R13.1 R65.2 R66.2 R67.2 ; port I_SENS
INP_1: R49.1 R51.1 U1.10(PA0) ; port INP_1
INP_2: C33.2 R50.1 R52.2 TP30.1(G9) U1.11(PA1) ; port INP_2
PWM_1_1: R29.2 TP15.1(G9) U1.29(PA8) U5.2(HIN) ; port PWM_1_1
PWM_1_2: R30.2 TP16.1(G9) U1.17(PA7) U5.3(LIN) ; port PWM_1_2
PWM_2_1: R40.2 TP23.1(G9) U1.30(PA9) U6.2(HIN) ; port PWM_2_1
PWM_2_2: R41.2 TP24.1(G9) U1.18(PB0) U6.3(LIN) ; port PWM_2_2
PWM_3_1: R58.2 TP33.1(G9) U1.31(PA10) U8.2(HIN) ; port PWM_3_1
PWM_3_2: R59.2 TP34.1(G9) U1.19(PB1) U8.3(LIN) ; port PWM_3_2
RESET: R6.1 U1.7(NRST) ; port RESET
SWCLC: P?.3 U1.37(PA14) ; port SWCLC
SWDIO: P?.2 U1.34(PA13) ; port SWDIO
Net*1_2: *1.2 U1.1(VBAT)
NetC1_1: C1.1(C) C2.1(C) J5.1 J6.1
NetC13_1: C13.1 JE2.2 R8.1
NetC13_2: C13.2 R8.2 VT1.1(E) VT2.1(E)
NetC14_1: C14.1 R10.2 R12.1
NetC14_2: C14.2 C16.1 R12.2 R16.1 TP18.1(G9) U4.3(FEEDBACK)
NetC15_1: C15.1 R15.2
NetC15_2: C15.2 JE6.1 JE8.2 JE9.1 JE10.1 T1.10 TP11.1(G9)
NetC16_2: C16.2 R16.2 R19.2 TP7.1(G9)
NetC17_1: C17.1 C18.1 D13.1(C) TP5.1(G9) U5.8(VB)
NetC17_2: C17.2 C18.2 D14.2(A) D20.1(C) L2.1 Q2.3(E) Q5.2(C) R21.1 U5.6(VS)
NetC22_1: C22.1 C24.2(A) Q3.4(C) R25.2 R28.2 TP19.1(G9) U4.13(OUTPUT_CTRL) U4.14(REF)
NetC23_1: C23.1 TP17.1(G9) U4.5(CT)
NetC24_1: C24.1(C) Q3.3(E) R22.1 TP12.1(G9) U4.4(DTC)
NetC25_1: C25.1 C26.1 D22.1(C) TP21.1(G9) U6.8(VB)
NetC25_2: C25.2 C26.2 D23.2(A) D26.1(C) L3.1 Q8.3(E) Q9.2(C) R39.1 U6.6(VS)
NetC29_1: C29.1 JE7.2 R45.1
NetC29_2: C29.2 R45.2 VT3.1(E) VT4.1(E)
NetC34_1: C34.1 C35.1 D29.1(C) TP31.1(G9) U8.8(VB)
NetC34_2: C34.2 C35.2 D30.2(A) D34.1(C) L5.1 Q12.3(E) Q14.2(C) R56.1 U8.6(VS)
NetC38_2: C38.2(A) C39.2(A) D36.1(C) D38.1(C) U9.1(INPUT)
NetC?#1_1: C?#1.1 U1.5(PF0-OSC_IN(PF0)) Y?.1
NetC?#2_1: C?#2.1 U1.6(PF1-OSC_OUT(PF1)) Y?.2
NetD3_2: D3.2(A) R1.1
NetD4_1: D4.1(C) R2.1 U2.2(INPUT_A-)
NetD9_1: D9.1(C) D11.1(C) D19.1(C) D21.1(C) JE2.1 R9.2 R20.2 R34.2 R35.2 R38.2
NetD9_2: D9.2(A) Q1.1(G) R9.1 TP2.1(G9)
NetD10_3: D10.3(A) D12.1(C) T1.1
NetD11_2: D11.2(A) Q4.1(G) R20.1
NetD15_3: D15.3(A) D17.1(C) T1.4
NetD16_1: D16.1(C) R17.2 R18.1 R21.2 TP10.1(G9)
NetD16_2: D16.2(A) Q2.1(G) R18.2
NetD18_1: D18.1(C) R31.1 R32.2 R33.2 TP20.1(G9)
NetD18_2: D18.2(A) Q5.1(G) R33.1
NetD19_2: D19.2(A) Q6.1(G) R34.1
NetD21_2: D21.2(A) Q7.1(G) R35.1
NetD24_1: D24.1(C) R36.1 R37.2 R39.2 TP22.1(G9)
NetD24_2: D24.2(A) Q8.1(G) R36.2
NetD25_1: D25.1(C) R42.1 R43.2 R47.2 TP26.1(G9)
NetD25_2: D25.2(A) Q9.1(G) R47.1
NetD27_1: D27.1(C) D28.1(C) D32.1(C) D35.1(C) JE7.1 R46.2 R53.2 R57.2 R63.2 R64.2 TP25.1(G9)
NetD27_2: D27.2(A) Q10.1(G) R46.1 TP28.1(G9)
NetD28_2: D28.2(A) Q11.1(G) R53.1
NetD31_1: D31.1(C) R54.1 R55.2 R56.2 TP32.1(G9)
NetD31_2: D31.2(A) Q12.1(G) R54.2
NetD32_2: D32.2(A) Q13.1(G) R57.1
NetD33_1: D33.1(C) R60.1 R61.2 R62.2 TP35.1(G9)
NetD33_2: D33.2(A) Q14.1(G) R62.1
NetD35_2: D35.2(A) Q15.1(G) R63.1
NetJ1_1: J1.1 J4.1 L1.1
NetJ7_1: J7.1 L2.2
NetJ8_1: J8.1 L3.2
NetJ9_1: J9.1 L5.2
NetJE1_1: JE1.1 JE3.1 JE4.1 JE5.1 R15.1 T1.7 TP1.1(G9)
NetJE1_2: JE1.2 Q1.2(D)
NetJE3_2: JE3.2 Q4.2(D)
NetJE4_2: JE4.2 Q6.2(D)
NetJE5_2: JE5.2 Q7.2(D)
NetJE6_2: JE6.2 Q10.2(D)
NetJE8_1: JE8.1 Q11.2(D)
NetJE9_2: JE9.2 Q13.2(D)
NetJE10_2: JE10.2 Q15.2(D)
NetL4_1: L4.1 U7.5(-IP)
NetR3_1: R3.1 R5.1(CCW) U2.3(INPUT_A+)
NetR4_2: R4.2 U2.1(OUTPUT_A)
NetR7_1: R7.1 R11.2 TP3.1(G9) VT1.3(B) VT2.3(B)
NetR7_2: R7.2 U4.9(E1)
NetR10_1: R10.1 R25.1 R26.1 TP4.1(G9) U4.2(1IN-)
NetR13_2: R13.2 R24.1 TP8.1(G9) U4.16(2IN+)
NetR14_2: R14.2 TP9.1(G9) U4.1(1IN+)
NetR17_1: R17.1 U5.7(HO)
NetR19_1: R19.1 R27.1 R28.1 U4.15(2IN-)
NetR23_1: R23.1 TP14.1(G9) U4.6(RT)
NetR31_2: R31.2 U5.5(LO)
NetR37_1: R37.1 U6.7(HO)
NetR42_2: R42.2 U6.5(LO)
NetR44_1: R44.1 R48.2 TP27.1(G9) VT3.3(B) VT4.3(B)
NetR44_2: R44.2 TP13.1(G9) U4.10(E2)
NetR50_2: R50.2 TP29.1(G9) U7.3(OUT)
NetR55_1: R55.1 U8.7(HO)
NetR60_2: R60.2 U8.5(LO)
NetR?_1: R?.1 U1.44(BOOT0)

Not connected (* = marked no-connect by the designer): D? 1(C) 2(A); R14 1; U1 2(PC13) 3(PC14-OSC32_IN(PC14)) 4(PC15-OSC32_OUT(PC15)) 12(PA2) 13(PA3) 14(PA4) 15(PA5) 16(PA6) 20(PB2) 21(PB10) 22(PB11) 25(PB12) 26(PB13) 27(PB14) 28(PB15) 32(PA11) 33(PA12) 38(PA15) 39(PB3) 40(PB4) 41(PB5) 42(PB6) 43(PB7) 45(PB8) 46(PB9); U2 5(INPUT_B+) 6(INPUT_B-) 7(OUTPUT_B)